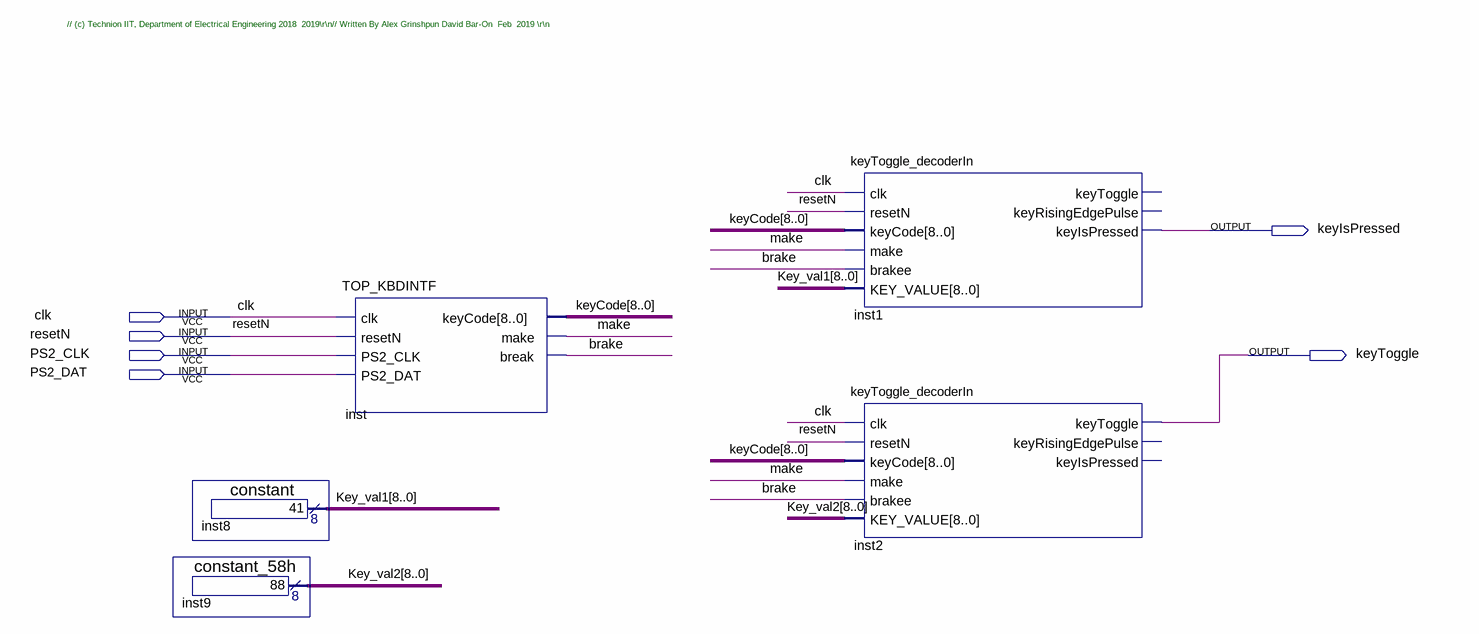
[diagram p0: schematic sheet]
// Quartus schematic TOP_KBD_DEMO.bdf as structural Verilog: 5 symbols, 6 pins
module TOP_KBD_DEMO (
  input  clk,
  input  resetN,
  input  PS2_CLK,
  input  PS2_DAT,
  output keyIsPressed,
  output keyToggle
);

  wire brake, make;
  wire [8:0] Key_val1, Key_val2, keyCode;

  constant_58h inst9 (.result(Key_val2));
  constant inst8 (.result(Key_val1));
  TOP_KBDINTF inst (
    .clk(clk), .resetN(resetN), .PS2_CLK(PS2_CLK), .PS2_DAT(PS2_DAT), .keyCode(keyCode), .make(make),
    .\break (brake));
  keyToggle_decoderIn inst1 (
    .clk(clk), .resetN(resetN), .keyCode(keyCode), .make(make), .brakee(brake), .KEY_VALUE(Key_val1),
    .keyIsPressed(keyIsPressed));  // open: keyToggle, keyRisingEdgePulse
  keyToggle_decoderIn inst2 (
    .clk(clk), .resetN(resetN), .keyCode(keyCode), .make(make), .brakee(brake), .KEY_VALUE(Key_val2),
    .keyToggle(keyToggle));  // open: keyRisingEdgePulse, keyIsPressed

  // Notes on the sheet:
  //   // (c) Technion IIT, Department of Electrical Engineering 2018  2019\r\n// Written By Alex Grinshpun David Bar-On  Feb  2019 \r\n
endmodule
